# Altium schematic sheet CLASS_AB.SchDoc
size Letter
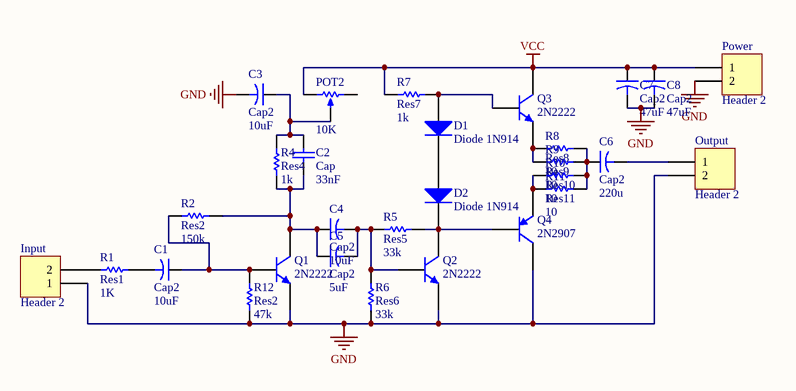
[diagram p0: CLASS_AB.SchDoc]

## Parts
C1  Cap2  value 10uF  [CAPR5-4X5]
C2  Cap  value 33nF  [RAD-0.3]
C3  Cap2  value 10uF  [CAPR5-4X5]
C4  Cap2  value 10uF  [CAPR5-4X5]
C5  Cap2  value 5uF  [CAPR5-4X5]
C6  Cap2  value 220u  [CAPR5-4X5]
C7  Cap2  value 47uF  [CAPR5-4X5]
C8  Cap2  value 47uF  [CAPR5-4X5]
D1  Diode 1N914  [DO-35]
D2  Diode 1N914  [DO-35]
Input  Header 2  [HDR1X2]
Output  Header 2  [HDR1X2]
POT2  value 10K  [POT inline wide]  (hidden comment: RPot_1)
Power  Header 2  [HDR1X2]
Q1  2N2222  [TO-92A]
Q2  2N2222  [TO-92A]
Q3  2N2222  [TO-92A]
Q4  2N2907  [TO-92A]
R1  Res1  value 1K  [AXIAL-0.3]
R2  Res2  value 150k  [AXIAL-0.3]
R4  Res4  value 1k  [AXIAL-0.3]
R5  Res5  value 33k  [AXIAL-0.3]
R6  Res6  value 33k  [AXIAL-0.3]
R7  Res7  value 1k  [AXIAL-0.3]
R8  Res8  value 10  [AXIAL-0.3]
R9  Res9  value 10  [AXIAL-0.3]
R10  Res10  value 10  [AXIAL-0.3]
R11  Res11  value 10  [AXIAL-0.3]
R12  Res2  value 47k  [AXIAL-0.3]

## Nets
GND: C3.2 C7.2 C8.2 Input.1 Output.2 Power.2 Q1.1(E) Q2.1(E) Q4.3(C) R6.1 R12.2
VCC: C7.1 C8.1 POT2.1(TOP) Power.1 Q3.3(C) R7.2
NetC1_1: C1.1 Q1.2(B) R2.2 R12.1
NetC1_2: C1.2 R1.2
NetC2_1: C2.1 C4.1 C5.1 Q1.3(C) R2.1 R4.2
NetC2_2: C2.2 C3.1 POT2.2(TAP) R4.1
NetC4_2: C4.2 C5.2 Q2.2(B) R5.2 R6.2
NetC6_1: C6.1 R8.1 R9.1 R10.1 R11.1
NetC6_2: C6.2 Output.1
NetD1_1: D1.1(A) Q3.2(B) R7.1
NetD1_2: D1.2(K) D2.1(A)
NetD2_2: D2.2(K) Q2.3(C) Q4.2(B) R5.1
NetInput_2: Input.2 R1.1
NetQ3_1: Q3.1(E) R8.2 R9.2
NetQ4_1: Q4.1(E) R10.2 R11.2

Not connected (* = marked no-connect by the designer): POT2 3(BOT)

## Library data of the parts
C1 C3-C8 = Cap2: Capacitor; Published: 23-Sep-2002; PackageReference: CAPR5-4X5; Publisher: Altium Limited; PackageDescription: Capacitor; 2 Leads
C2 = Cap: Capacitor; Published: 8-Jun-2000; LatestRevisionDate: 17-Jul-2002; LatestRevisionNote: Re-released for DXP Platform.; PackageReference: RAD-0.3; Publisher: Altium Limited; PackageDescription: Radial Cap, Thru-Hole; 2 Leads; 0.3 in Pin Spacing
D1 D2 = Diode 1N914: High Conductance Fast Diode; Published: 8-Jun-2000; LatestRevisionDate: 17-Jul-2002; LatestRevisionNote: Re-released for DXP Platform.; DatasheetVersion: 1997; PackageReference: DO-35; Publisher: Altium Limited; PackageDescription: Diode, Axial; Body 3.8 x 1.9 mm (LxDia. max), Lead Dia. 0.53 mm (max); Code_JEDEC: DO-204-AH; ComponentLink1Description: Manufacturer Link; ComponentLink1URL: http://www.fairchildsemi.com/; ComponentLink2Description: Datasheet; ComponentLink2URL: http://www.fairchildsemi.com/ds/1N%2F1N4448.pdf
Input Output Power = Header 2: Header, 2-Pin; LatestRevisionDate: 17-Jul-2002; LatestRevisionNote: Re-released for DXP Platform.; Publisher: Altium Limited
POT2 = RPot_3: Potentiometer; Sim Note: Enter the Resistance value and the set point into parameter fields.; Set Position: 0.5; Published: 8-Jun-2000; LatestRevisionDate: 17-Jul-2002; LatestRevisionNote: Re-released for DXP Platform.; PackageReference: VR5; Publisher: Altium Limited; PackageDescription: Variable Resistor, Thru-Hole; 3 Leads
Q1-Q3 = 2N3904: NPN General Purpose Amplifier; Published: 8-Jun-2000; LatestRevisionDate: 15-Jan-2003; LatestRevisionNote: PCB Footprint 'BCY-W3/D4.7' replaced; DatasheetVersion: 1997; PackageVersion: Sep-1998; PackageReference: TO-92A; Publisher: Altium Limited; PackageDescription: TO, Flat Index; 3 In-Line, Axial Leads; Body Dia. 4.5mm; Leads 0.51 x 0.48 mm (max); ComponentLink1Description: Manufacturer Link; ComponentLink1URL: http://www.fairchildsemi.com/; ComponentLink2Description: Datasheet; ComponentLink2URL: http://www.fairchildsemi.com/ds/2N%2F2N3904.pdf
Q4 = 2N3906: PNP General Purpose Amplifier; Published: 8-Jun-2000; LatestRevisionDate: 15-Jan-2003; LatestRevisionNote: PCB Footprint 'BCY-W3/D4.7' replaced; DatasheetVersion: 1997; PackageVersion: Sep-1998; PackageReference: TO-92A; Publisher: Altium Limited; PackageDescription: TO, Flat Index; 3 In-Line, Axial Leads; Body Dia. 4.5mm; Leads 0.51 x 0.48 mm (max); ComponentLink1Description: Manufacturer Link; ComponentLink1URL: http://www.fairchildsemi.com/; ComponentLink2Description: Datasheet; ComponentLink2URL: http://www.fairchildsemi.com/ds/2N%2F2N3906.pdf
R1 R2 R4-R12 = Res1: Resistor; Published: 8-Jun-2000; LatestRevisionDate: 17-Jul-2002; LatestRevisionNote: Re-released for DXP Platform.; PackageReference: AXIAL-0.3; Publisher: Altium Limited; PackageDescription: Axial Device, Thru-Hole; 2 Leads; 0.3 in Pin Spacing